# Altium schematic sheet CurrentTrans-board-multi.SchDoc
size A4
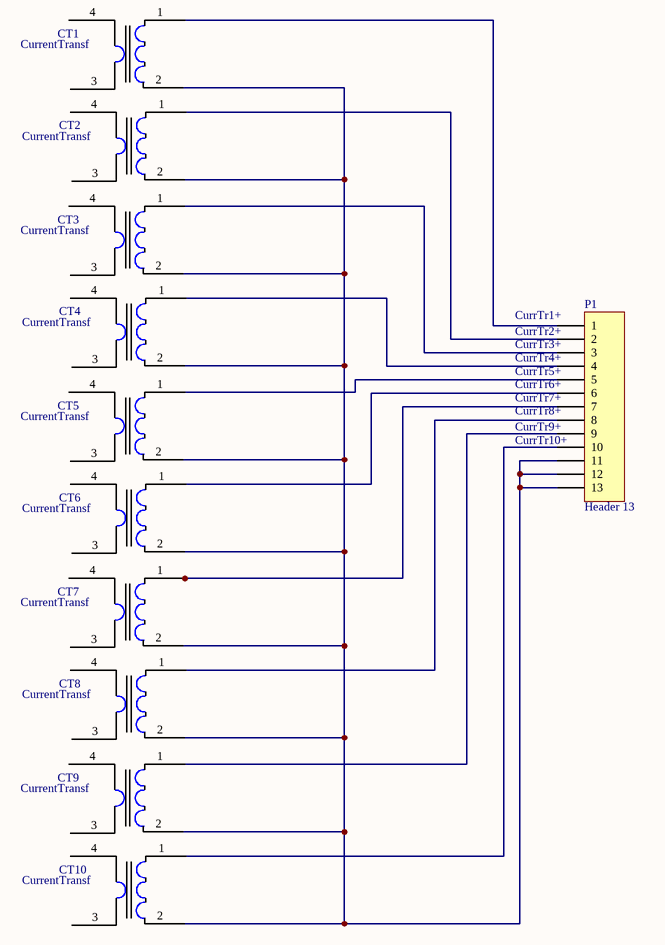
[diagram p0: CurrentTrans-board-multi.SchDoc]

## Parts
CT1  CurrentTransf  [CT-ZMCT124]
CT2  CurrentTransf  [CT-ZMCT124]
CT3  CurrentTransf  [CT-ZMCT124]
CT4  CurrentTransf  [CT-ZMCT124]
CT5  CurrentTransf  [CT-ZMCT124]
CT6  CurrentTransf  [CT-ZMCT124]
CT7  CurrentTransf  [CT-ZMCT124]
CT8  CurrentTransf  [CT-ZMCT124]
CT9  CurrentTransf  [CT-ZMCT124]
CT10  CurrentTransf  [CT-ZMCT124]
P1  Header 13  [HDR1X13]

## Nets
NetCT1_1: CT1.1 P1.1
NetCT1_2: CT1.2 CT2.2 CT3.2 CT4.2 CT5.2 CT6.2 CT7.2 CT8.2 CT9.2 CT10.2 P1.11 P1.12 P1.13
NetCT2_1: CT2.1 P1.2
NetCT3_1: CT3.1 P1.3
NetCT4_1: CT4.1 P1.4
NetCT5_1: CT5.1 P1.5
NetCT6_1: CT6.1 P1.6
NetCT7_1: CT7.1 P1.7
NetCT8_1: CT8.1 P1.8
NetCT9_1: CT9.1 P1.9
NetCT10_1: CT10.1 P1.10

Not connected (* = marked no-connect by the designer): CT1 3 4; CT2 3 4; CT3 3 4; CT4 3 4; CT5 3 4; CT6 3 4; CT7 3 4; CT8 3 4; CT9 3 4; CT10 3 4

## Notes on the sheet
- (near P1) CurrTr3+
- (near P1) CurrTr1+
- (near P1) CurrTr2+
- (near P1) CurrTr5+
- (near P1) CurrTr6+
- (near P1) CurrTr7+
- (near P1) CurrTr8+
- (near P1) CurrTr4+
- (near P1) CurrTr10+
- (near P1) CurrTr9+

## Library data of the parts
CT1 = CurrentTransf: CurrentTransf ZMCT116A; Manufacturer: NanJing ZeMing Electronics Co.Ltd; Mfr.PN#: ZMCT116A
CT7 = CurrentTransf: Manufacturer: NanJing ZeMing Electronics Co.Ltd; Suppl.PN#: ZMCT116A; Supplier: NanJing ZeMing Electronics Co.Ltd
P1 = Header 13: Header, 13-Pin; Manufacturer: JYR Ecec Co.,Ltd China; Mfr.PN#: 2.54mm 90 degree singlw row 13 pins; LatestRevisionDate: 17-Jul-2002; LatestRevisionNote: Re-released for DXP Platform.; Publisher: Altium Limited; Link: http://jyrcon.en.alibaba.com/product/60262288613-800882385/2_54mm_pitch_single_row_3_pin_male_header_90degree.html; Supplier: Alibaba